# Altium project LT3015_LT1963_TPS74401.PrjPcb
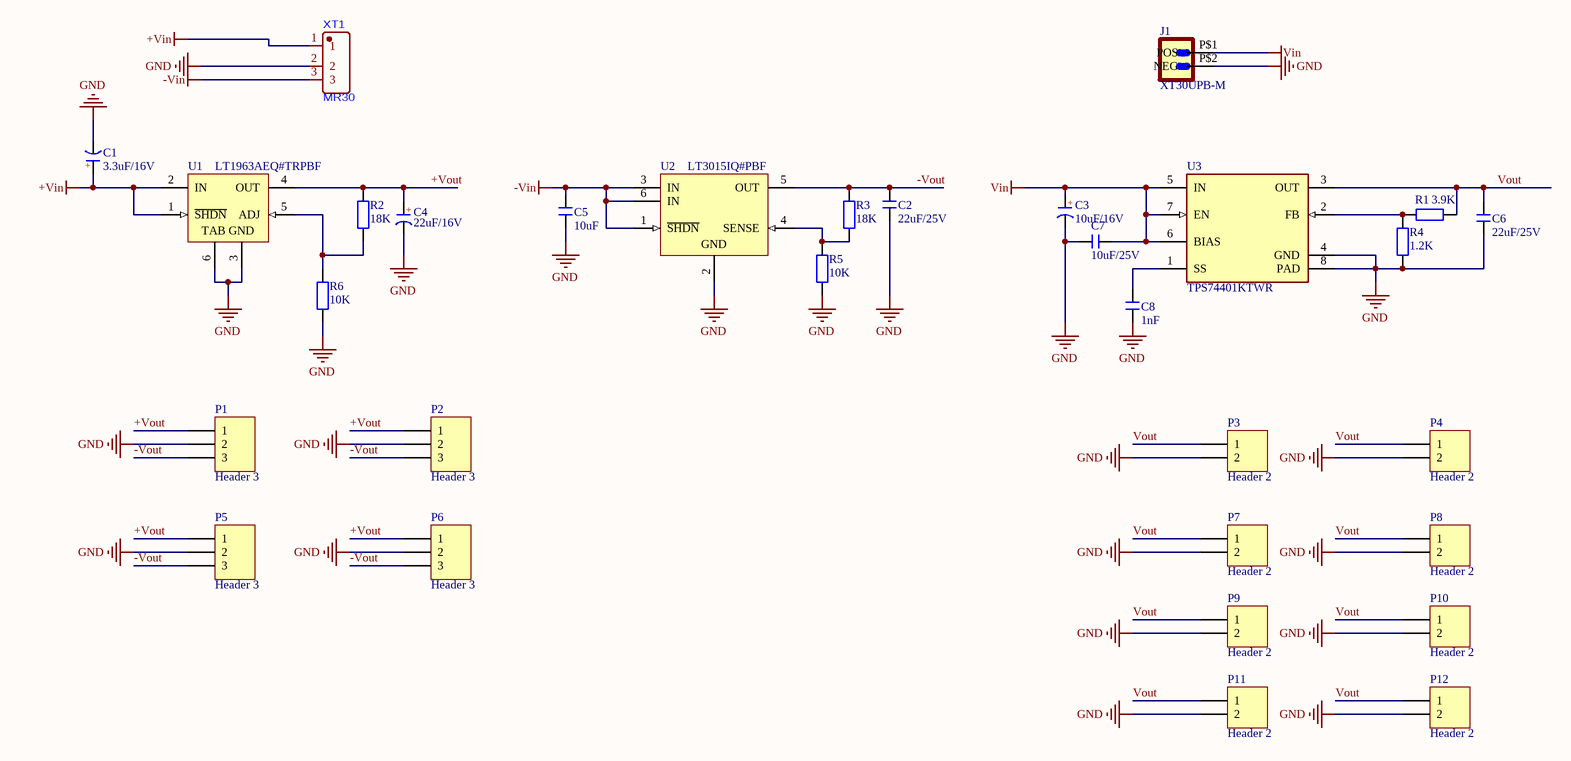
[diagram p0: LT3015_LT1963_TPS74401.SchDoc]
1 sheet, 31 parts. Net scope: global (net labels, ports and power ports of the same name join across sheets).
Board file: LT3015_LT1963_TPS74401.PcbDoc

## Sheet LT3015_LT1963_TPS74401.SchDoc
size A2; SheetNumber: 1; SheetTotal: 1

### Parts
C1  3.3uF/16V  [CD A(3216)]
C2  22uF/25V  [C 0805_L]
C3  10uF/16V  [CD A(3216)]
C4  22uF/16V  [CD A(3216)]
C5  10uF  [C 0805_L]
C6  22uF/25V  [C 0805_L]
C7  10uF/25V  [C 0805_L]
C8  1nF  [C 0603_L]
J1  XT30UPB-M  [XT30UPB-M]
P1  Header 3  [HDR1X3]
P2  Header 3  [HDR1X3]
P3  Header 2  [HDR1X2]
P4  Header 2  [HDR1X2]
P5  Header 3  [HDR1X3]
P6  Header 3  [HDR1X3]
P7  Header 2  [HDR1X2]
P8  Header 2  [HDR1X2]
P9  Header 2  [HDR1X2]
P10  Header 2  [HDR1X2]
P11  Header 2  [HDR1X2]
P12  Header 2  [HDR1X2]
R1  3.9K  [R 0603_L]
R2  18K  [R 0603_L]
R3  18K  [R 0603_L]
R4  1.2K  [R 0603_L]
R5  10K  [R 0603_L]
R6  10K  [R 0603_L]
U1  LT1963AEQ#TRPBF  [LT-Q-5_L]
U2  LT3015IQ#PBF  [LT-Q-5_L]
U3  TPS74401KTWR  [FP-KTW0007A-MFG]
XT1  MR30  [CONN-TH_MR30-M]

### Nets
+Vin: C1.1(A) U1.1(~{SHDN}) U1.2(IN) XT1.1
-Vin: C5.2 U2.1(~{SHDN}) U2.3(IN) U2.6(IN) XT1.3
GND: C1.2(K) C2.1 C3.2(K) C4.2(K) C5.1 C6.1 C7.2 C8.1 J1.P$2(NEG) P1.2 P2.2 P3.2 P4.2 P5.2 P6.2 P7.2 P8.2 P9.2 P10.2 P11.2 P12.2 R4.1 R5.1 R6.1 U1.3(GND) U1.6(TAB) U2.2(GND) U3.4(GND) U3.8(PAD) XT1.2
Vin: C3.1(A) C7.1 J1.P$1(POS) U3.5(IN) U3.6(BIAS) U3.7(EN)
+Vout: C4.1(A) P1.1 P2.1 P5.1 P6.1 R2.2 U1.4(OUT)
-Vout: C2.2 P1.3 P2.3 P5.3 P6.3 R3.2 U2.5(OUT)
Vout: C6.2 P3.1 P4.1 P7.1 P8.1 P9.1 P10.1 P11.1 P12.1 R1.1 U3.3(OUT)
NetC8_2: C8.2 U3.1(SS)
NetR1_2: R1.2 R4.2 U3.2(FB)
NetR2_1: R2.1 R6.2 U1.5(ADJ)
NetR3_1: R3.1 R5.2 U2.4(SENSE)

### Notes on the sheet
- (in symbol CT) +

### Library data of the parts
C1 C3 C4 = CT: 贴片钽电容; 淘宝ID: 小糖豆的小窝窝; BOM名称: 贴片钽电容; 下单链接: https://item.taobao.com/item.htm?ft=t&id=613637044352
C2 C5-C8 = C: 贴片电容; 淘宝ID: 小糖豆的小窝窝; BOM名称: 贴片电容; 下单链接: https://item.taobao.com/item.htm?ft=t&id=613637044352
J1 = XT30UPB-M: Socket; DC supply; XT30; male; PIN: 2; on PCBs; THT; yellow; 15A; 500V; MF: amass; Price: None; Value: *; Package: None; MP: XT30UPB-M; Availability: Not in stock
P1 P2 P5 P6 = Header 3: Header, 3-Pin; LatestRevisionDate: 17-Jul-2002; LatestRevisionNote: Re-released for DXP Platform.; Publisher: Altium Limited
P3 P4 P7-P12 = Header 2: Header, 2-Pin; LatestRevisionDate: 17-Jul-2002; LatestRevisionNote: Re-released for DXP Platform.; Publisher: Altium Limited
R1-R6 = R: 贴片电阻; 淘宝ID: 小糖豆的小窝窝; BOM名称: 贴片电阻; 下单链接: https://item.taobao.com/item.htm?ft=t&id=613637044352
U1 = CMP-0476-01133-1: 1.5 A, Low Noise, Fast Transient Response LDO Regulator, 2.1 to 20 V Vin, Adjustable Vout, 5-pin DPAK (Q-5), -40 to 125 degC, Pb-Free, Tape and Reel; Manufacturer: Linear Technology; Noise(uV): 40; Vout Max(V): 20; Isupply(mA): 1; PSRR(dB): 63; Discrete Pass Element: no; Dropout Voltage(V): 0.34; Vout Min(V): 1.21; Vin Min(V): 2.1; Output Voltage: Adj; Shutdown Current(uA): 0.01; Iout(mA): 1500; ComponentLink3URL: http://cds.linear.com/docs/en/packaging/Q%20DD5%2005-08-1461%20Rev%20F.pdf; Packing: Tape and Reel; Mounting Technology: Surface Mount; PackageReference: Q-5; RoHS: TRUE; Number of Outputs: 1; PartNumber: LT1963AEQ#TRPBF; ComponentLink3Description: Package Specification; Vin Max(V): 20; ComponentLink2URL: http://cds.linear.com/docs/en/datasheet/1963afe.pdf; ComponentLink2Description: Datasheet; ComponentLink1Description: Manufacturer URL; ComponentLink1URL: http://www.linear.com/; PackageVersion: Rev. F, 09/2011; DatasheetVersion: Rev. E; PackageDescription: 5-Pin Plastic DD Pak, Body 10.2235 x 8.89 mm, Pitch 1.702 mm
U2 = CMP-0476-01078-1: 1.5 A, Low Noise, Negative Linear Regulator with Precision Current Limit, -1.8 to -30 V Vin, Adjustable Vout, 5-pin DPAK (Q-5), -40 to 125 degC, Pb-Free; Manufacturer: Linear Technology; Output Voltage: Adj; Noise(uV): 60; Shutdown Current(uA): 17; Dropout Voltage(V): 0.31; Number of Outputs: 1; Isupply(mA): 1.1; Discrete Pass Element: no; Vout Max(V): -1.22; PSRR(dB): 65; Vout Min(V): -29.3; Iout(mA): 1500; Vin Max(V): -1.8; ComponentLink1Description: Manufacturer URL; ComponentLink3URL: http://cds.linear.com/docs/en/packaging/Q%20DD5%2005-08-1461%20Rev%20F.pdf; PartNumber: LT3015IQ#PBF; ComponentLink2URL: http://cds.linear.com/docs/en/datasheet/3015fb.pdf; PackageVersion: Rev. F, 09/2011; Mounting Technology: Surface Mount; RoHS: TRUE; PackageDescription: 5-Pin Plastic DD Pak, Body 10.2235 x 8.89 mm, Pitch 1.702 mm; ComponentLink3Description: Package Specification; DatasheetVersion: Rev. B; Vin Min(V): -30; PackageReference: Q-5; ComponentLink2Description: Datasheet; ComponentLink1URL: http://www.linear.com/
U3 = CMP-04917-000141-1: IC REG LIN POS ADJ 3A DDPAK; Number of Regulators: 1; Min Input Voltage: 800mV; Max Input Voltage: 5.5V; Max Power Dissipation: 5.32W; Accuracy: 1%; Min Current Limit: 3.5A; Dropout Voltage: 120mV; Output Voltage: 3.6V; Polarity: Positive; Input Bias Current: 2mA; Quiescent Current: 3mA; Reference Voltage: 804mV; Output Type: Adjustable; Radiation Hardening: No; Lead Free: Lead Free; Series: -; RoHS Compliant: Yes; Case/Package: TO-263; Output Current: 3A; Max Output Current: 3A; Packaging: Tape and Reel; Package Quantity: 1; Number of Outputs: 1; Mount: Surface Mount; Power Dissipation: 5.32W; Number of Pins: 7; Min Operating Temperature: -40°C; Max Operating Temperature: 125°C; Length: 10.1mm; Max Output Voltage: 3.6V; Output Voltage Accuracy: 1%; Contact Plating: Tin; Width: 8.89mm; Height: 4.44mm; Min Output Voltage: 800mV